# EAGLE design control_dev (EAGLE 8.3.2)
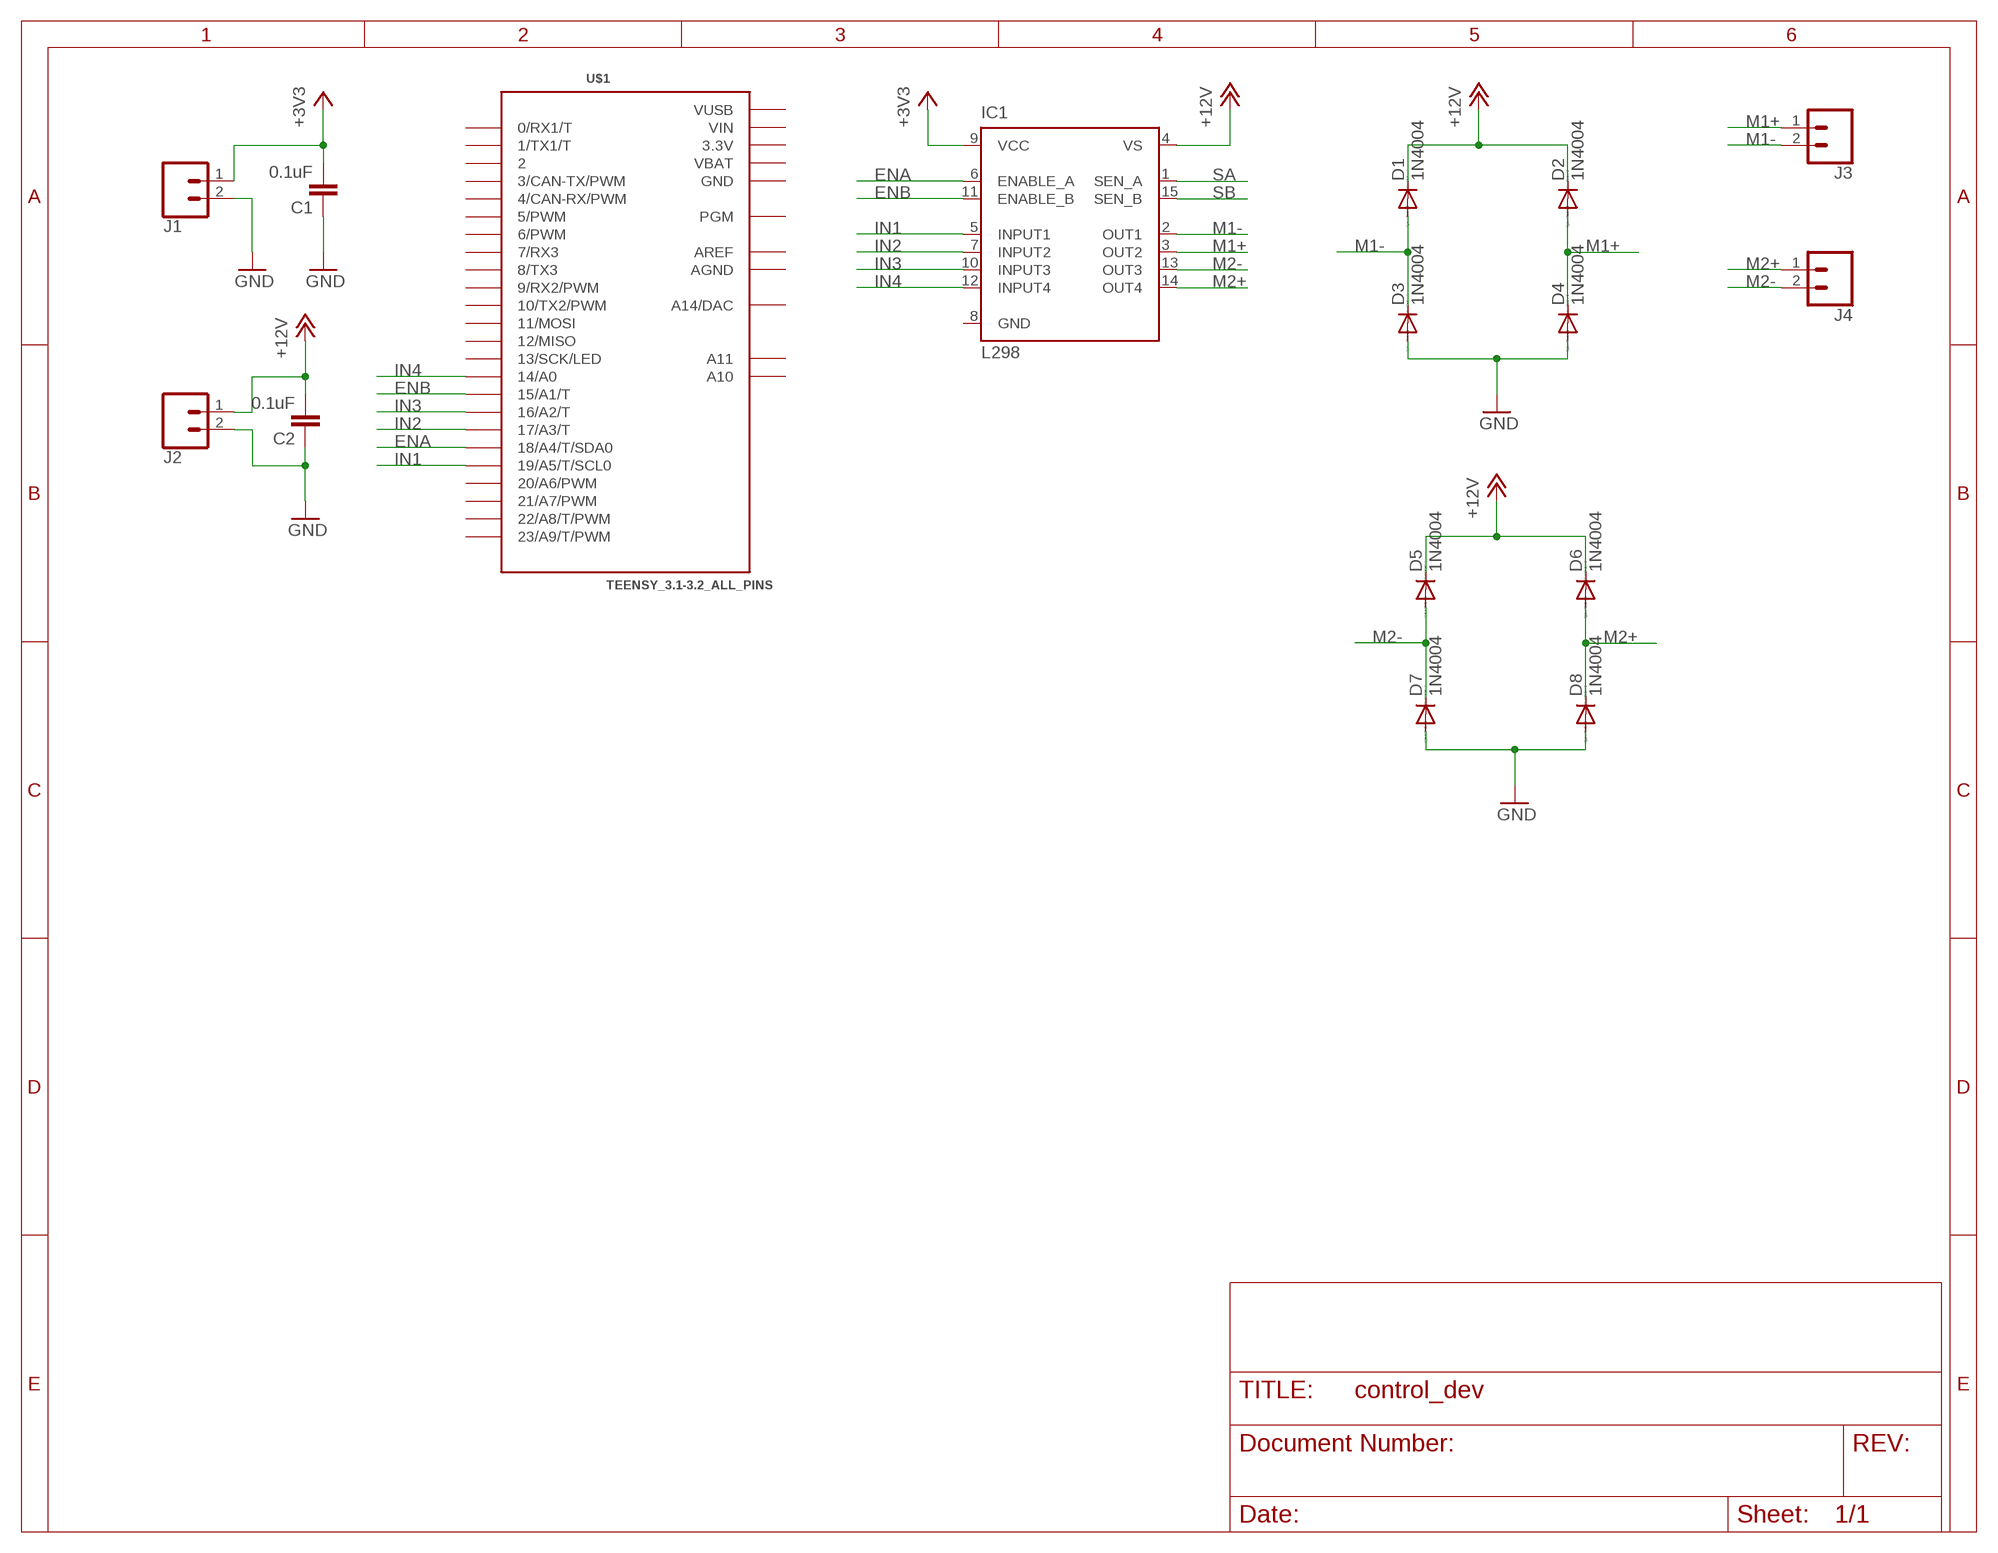
[diagram p0: schematic, sheet 1]

## Parts
C1  0.1uF  0.1UF-KIT-EZ-50V-20%  [CAP-PTH-SMALL-KIT]
C2  0.1uF  0.1UF-KIT-EZ-50V-20%  [CAP-PTH-SMALL-KIT]
D1  1N4004  [DO41-10]
D2  1N4004  [DO41-10]
D3  1N4004  [DO41-10]
D4  1N4004  [DO41-10]
D5  1N4004  [DO41-10]
D6  1N4004  [DO41-10]
D7  1N4004  [DO41-10]
D8  1N4004  [DO41-10]
IC1  L298  [MULTIWATT-15]
J1  CONN_023.5MM  [SCREWTERMINAL-3.5MM-2]
J2  CONN_023.5MM  [SCREWTERMINAL-3.5MM-2]
J3  CONN_023.5MM  [SCREWTERMINAL-3.5MM-2]
J4  CONN_023.5MM  [SCREWTERMINAL-3.5MM-2]
U$1  TEENSY_3.1-3.2_ALL_PINS  [TEENSY_3.0-3.2&LC_ALL_PINS]

## Nets
+3V3: C1.2 IC1.9(VCC) J1.1
+12V: C2.2 D1.C D2.C D5.C D6.C IC1.4(VS) J2.1
ENA: IC1.6(ENABLE_A) U$1.18/A4(18/A4/T/SDA0)
ENB: IC1.11(ENABLE_B) U$1.15/A1(15/A1/T)
GND: C1.1 C2.1 D3.A D4.A D7.A D8.A J1.2 J2.2
IN1: IC1.5(INPUT1) U$1.19/A5(19/A5/T/SCL0)
IN2: IC1.7(INPUT2) U$1.17/A3(17/A3/T)
IN3: IC1.10(INPUT3) U$1.16/A2(16/A2/T)
IN4: IC1.12(INPUT4) U$1.14/A0
M1+: D2.A D4.C IC1.3(OUT2) J3.1
M1-: D1.A D3.C IC1.2(OUT1) J3.2
M2+: D6.A D8.C IC1.14(OUT4) J4.1
M2-: D5.A D7.C IC1.13(OUT3) J4.2
SA: IC1.1(SEN_A)
SB: IC1.15(SEN_B)
Unconnected: U$1.0(0/RX1/T) U$1.1(1/TX1/T) U$1.2 U$1.3(3/CAN-TX/PWM) U$1.4(4/CAN-RX/PWM) U$1.5(5/PWM) U$1.6(6/PWM) U$1.7(7/RX3) U$1.8(8/TX3) U$1.9(9/RX2/PWM) U$1.10(10/TX2/PWM) U$1.11(11/MOSI) U$1.12(12/MISO) U$1.13(13/SCK/LED) U$1.20/A6(20/A6/PWM) U$1.21/A7(21/A7/PWM) U$1.22/A8(22/A8/T/PWM) U$1.23/A9(23/A9/T/PWM) U$1.A10 U$1.A11 U$1.PGM U$1.RESET/DAC(A14/DAC)

## Power pins joined to a net without a drawn wire
3.3V: U$1.3.3V U$1.3.3V1(3.3V)
AGND: U$1.AGND
AREF: U$1.AREF
GND: IC1.8(GND) U$1.GND U$1.GND1(GND)
VBAT: U$1.VBAT
VIN: U$1.VIN
VUSB: U$1.VUSB

## Library data of the parts
C1 C2 = SparkFun-Capacitors:0.1UF: 0.1µF ceramic capacitors A capacitor is a passive two-terminal electrical component used to store electrical energy temporarily in an electric field.; PROD_ID: CAP-08370
D1-D8 = diode:1N4004: DIODE general purpose rectifier, 1 A
IC1 = st-microelectronics:L298: DUAL FULL-BRIDGE DRIVER; MPN: L298N; OC_FARNELL: 1589425; OC_NEWARK: 32M1527
J1-J4 = SparkFun-Connectors:CONN_02: Multi connection point. Often used as Generic Header-pin footprint for 0.1 inch spaced/style header connections On any of the 0.1 inch spaced packages, you can populate with these: Break Away Headers - Straight <https://www.sparkfun.com/products/116> (PRT-00116) Break Away Male Headers - Right Angle <https://www.sparkfun.com/products/553> (PRT-00553) Female Headers <https://www.sparkfun.com/products/115> (PRT-00115) Break Away Headers - Machine Pin <https://www.sparkfun.com/products/117> (PRT-00117) Break Away Female Headers - Swiss Machine Pin <https://www.sparkfun.com/products/743> (PRT-00743) For SCREWTERMINALS and SPRING TERMINALS visit here: Screw Terimnals on SparkFun.com <https://www.sparkfun.com/search/results?term=Screw+Terminals> (5mm/3.5mm/2.54mm spacing) This device is also useful as a general connection point to wire up your design to another part of your project. Our various solder wires solder well into these plated through hole pads. Hook-Up Wire - Assortment (Stranded, 22 AWG) <https://www.sparkfun.com/products/11375> (PRT-11375) Hook-Up Wire - Assortment (Solid Core, 22 AWG) <https://www.sparkfun.com/products/11367> (PRT-11367) View the entire wire category on our website here <https://www.sparkfun.com/categories/141> Special notes: Molex polarized connector foot print use with: PRT-08233 with associated crimp pins and housings. 2.54_SCREWTERM for use with PRT-10571. 3.5mm Screw Terminal footprints for PRT-08084 5mm Screw Terminal footprints for use with PRT-08432; PROD_ID: CONN-08399
U$1 = Teensy_3_and_LC_Series_Boards_v1.4:TEENSY_3.1-3.2_ALL_PINS: Footprint for Teensy 3.1 or 3.2 board using all through-holes, i.e. the entire perimeter plus the 4 through-holes inboard (A10,A11,AREF, VUSB)

## Board
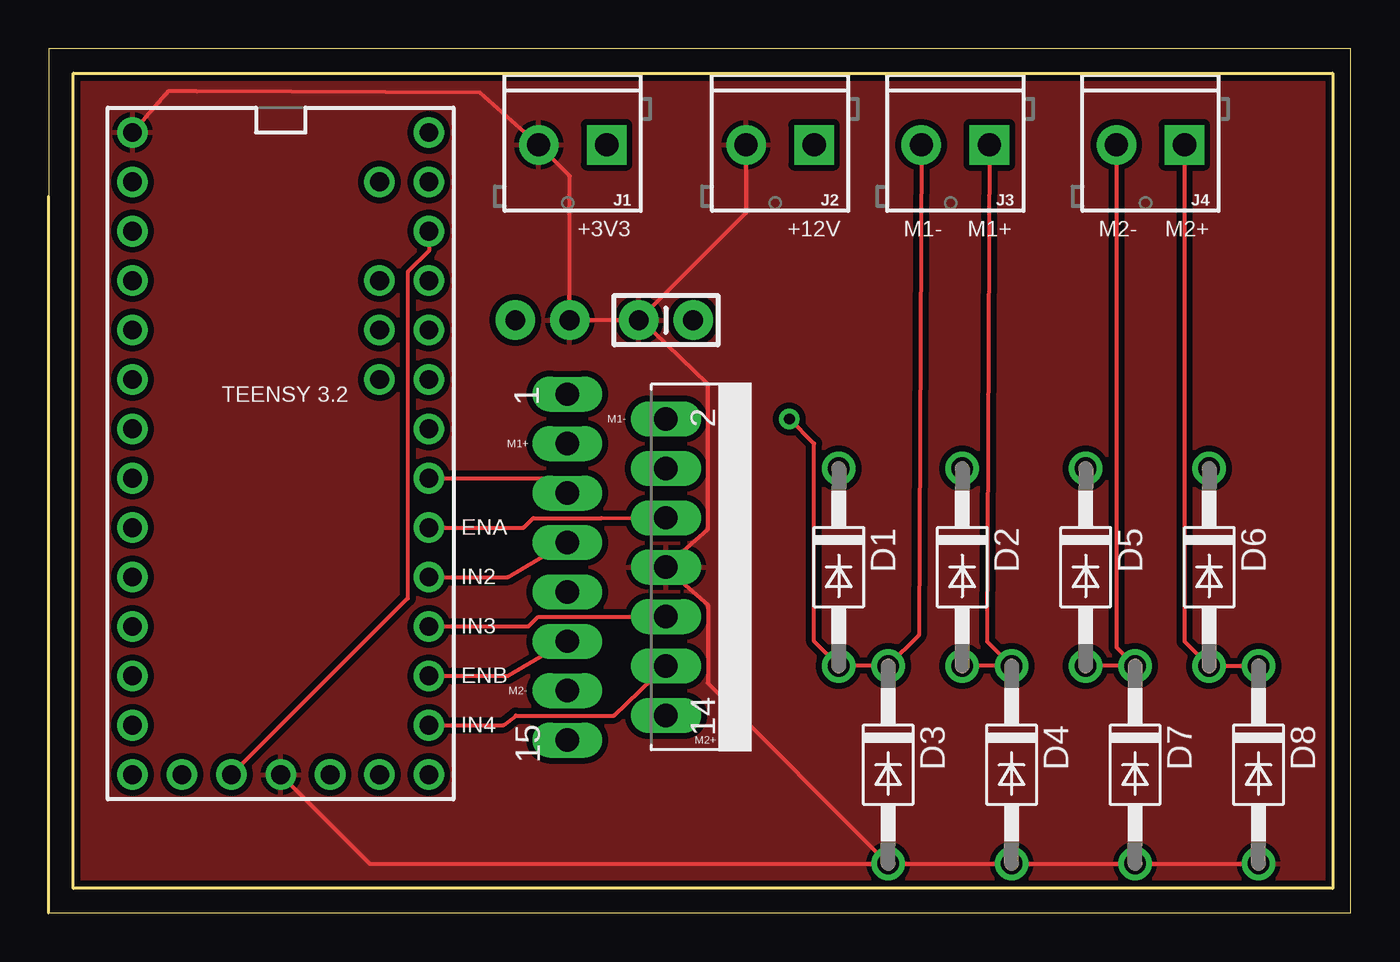
[diagram p1: board, top side]
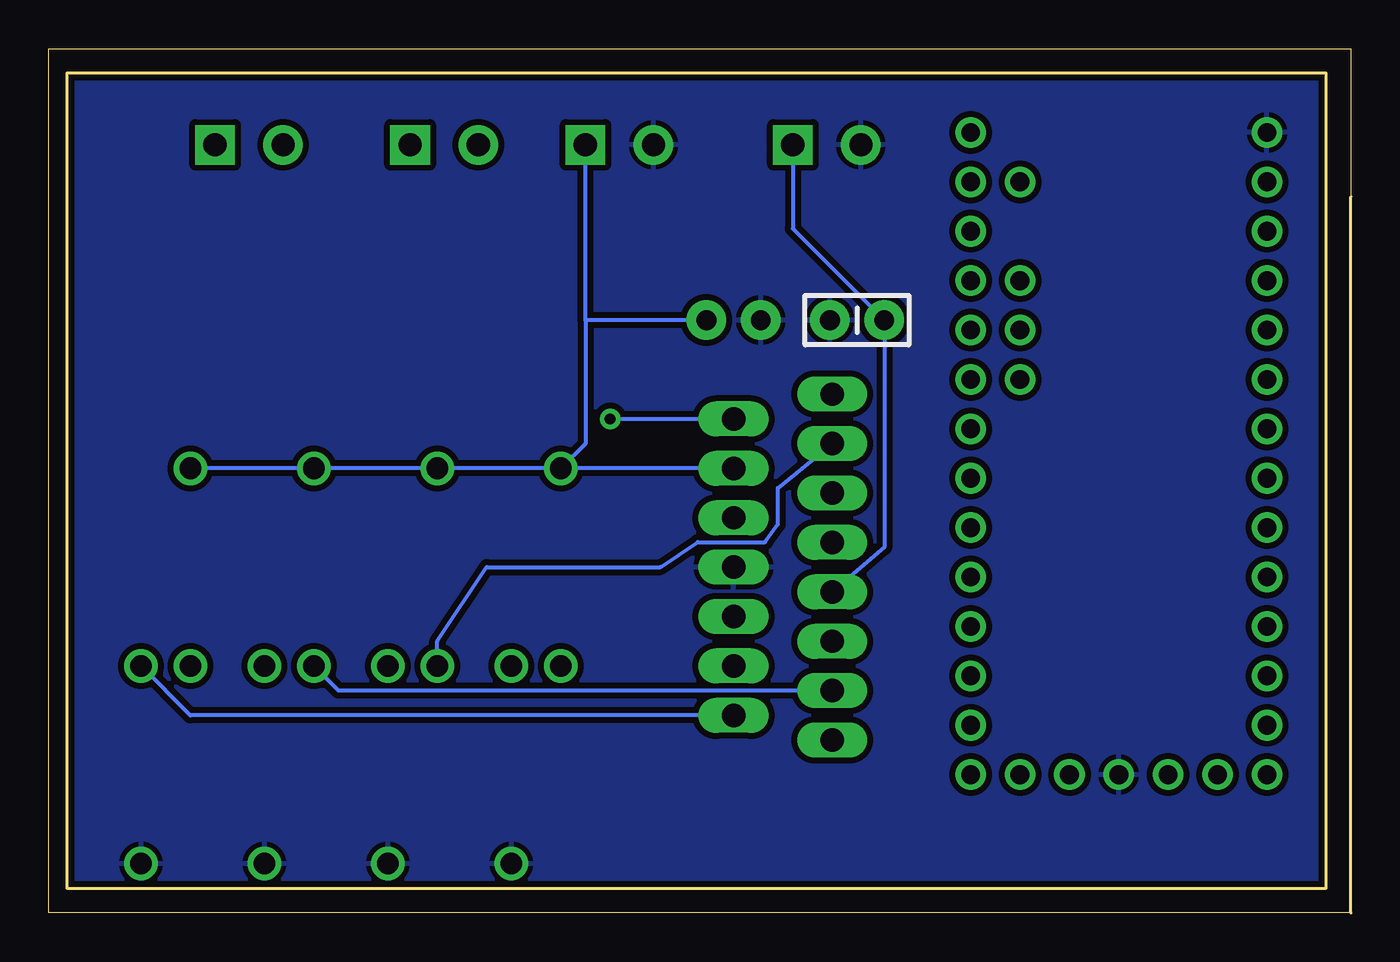
[diagram p2: board, bottom side, seen from below]

Size 66.98 x 44.44 mm. Coordinates in mm from the lower left corner, seen from the top.
Outline: 0,0 66.98,0 66.98,44.44 0,44.44 0,36.83 0,0
Outline: 1.27,1.27 1.27,43.18 66.04,43.18 66.04,1.27 1.27,1.27
Copper layers (1*16): Top 0.035mm / dielectric 1.5mm / Bottom 0.035mm
Design rules "SparkFun": minimum track width 8mil, minimum drill 20mil, track to track 8mil, track to pad 8mil, pad to pad 8mil, via to via 8mil, smd to smd 8mil, copper to edge 8mil, drill to drill 8mil, minimum pad ring 12mil, minimum via ring 10mil, stop-mask expansion 4mil, vias tented up to drill 20mil, thermal gap 10mil

### Footprints (pad centres in the part's own frame; a part is rotated, then mirrored left to right if it is on the bottom)
CAP-PTH-SMALL-KIT = drill 1.016 pad 2.032: 1 -1.397,0; 2 1.397,0
DO41-10 = drill 1.118: A 5.08,0; C -5.08,0
MULTIWATT-15 = drill 1.2 long: 1 -8.89,-7.62; 2 -7.62,-2.54; 3 -6.35,-7.62; 4 -5.08,-2.54; 5 -3.81,-7.62; 6 -2.54,-2.54; 7 -1.27,-7.62; 8 0,-2.54; 9 1.27,-7.62; 10 2.54,-2.54; 11 3.81,-7.62; 12 5.08,-2.54; 13 6.35,-7.62; 14 7.62,-2.54; 15 8.89,-7.62
SCREWTERMINAL-3.5MM-2 = drill 1.2 pad 2.032 square: 1 0,0 | drill 1.2 pad 2.032: 2 3.5,0
TEENSY_3.0-3.2&LC_ALL_PINS = drill 0.965: 0 -7.62,13.97; 1 -7.62,11.43; 2 -7.62,8.89; 3 -7.62,6.35; 3.3V 7.62,11.43; 3.3V1 -2.54,-16.51; 4 -7.62,3.81; 5 -7.62,1.27; 6 -7.62,-1.27; 7 -7.62,-3.81; 8 -7.62,-6.35; 9 -7.62,-8.89; 10 -7.62,-11.43; 11 -7.62,-13.97; 12 -7.62,-16.51; 13 7.62,-16.51; 14/A0 7.62,-13.97; 15/A1 7.62,-11.43; 16/A2 7.62,-8.89; 17/A3 7.62,-6.35; 18/A4 7.62,-3.81; 19/A5 7.62,-1.27; 20/A6 7.62,1.27; 21/A7 7.62,3.81; 22/A8 7.62,6.35; 23/A9 7.62,8.89; A10 5.08,6.35; A11 5.08,3.81; AGND 7.62,13.97; AREF 5.08,8.89; GND -7.62,16.51; GND1 0,-16.51; PGM 2.54,-16.51; RESET/DAC 5.08,-16.51; VBAT -5.08,-16.51; VIN 7.62,16.51; VUSB 5.08,13.97

### Placement (x,y rotation side)
C1  25.4,30.48 0 bottom
C2  31.75,30.48 0 top
D1  40.64,17.78 270 top
D2  46.99,17.78 270 top
D3  43.18,7.62 270 top
D4  49.53,7.62 270 top
D5  53.34,17.78 270 top
D6  59.69,17.78 270 top
D7  55.88,7.62 270 top
D8  62.23,7.62 270 top
IC1  34.29,17.78 270 top
J1  28.7,39.5 180 top
J2  39.37,39.5 180 top
J3  48.39,39.5 180 top
J4  58.42,39.5 180 top
U$1  11.94,23.62 0 top

### Tracks (layer width: path | path; a pad name or v marks a point on that pad's centre or on a via)
3.3V
  Top 0.203: U$1.3.3V 19.56,34.06 18.47,32.96 18.47,16.18 U$1.3.3V1
+3V3
  Bottom 0.203: J1.1 28.7,35.18 C1.2 24,18.8 IC1.9
+12V
  Bottom 0.203: D1.C 39.37,24.13 39.37,30.48 | IC1.4 D1.C | D1.C D2.C D5.C D6.C | 39.37,30.48 J2.1 | C2.2 39.37,30.48
ENA
  Top 0.203: U$1.18/A4 24.43,19.81 24.92,20.31 28.43,20.31 IC1.6
ENB
  Top 0.203: U$1.15/A1 23.62,12.19 IC1.11
GND
  Top 0.203: D3.A 16.51,2.54 U$1.GND1 | D3.A 33.91,11.81 33.91,15.83 31.75,17.74 IC1.8 31.75,17.82 33.91,19.73 33.91,27.18 30.42,30.54 | U$1.GND 6.15,42.24 7.64,42.24 22.19,42.16 J1.2 26.8,37.9 C1.1 C2.1 30.42,30.54 | J2.2 35.87,36 30.42,30.54 | D3.A D4.A D7.A D8.A
  pour Top (isolate 0.305): 1.27,41.91 1.27,1.27 66.04,1.27 66.04,43.18 1.27,43.18
  pour Bottom (isolate 0.305): 1.27,43.18 1.27,1.27 66.04,1.27 66.04,43.18
IN1
  Top 0.203: U$1.19/A5 25.91,22.35 IC1.5
IN2
  Top 0.203: U$1.17/A3 23.62,17.27 IC1.7
IN3
  Top 0.203: U$1.16/A2 24.68,14.73 25.18,15.23 29.83,15.23 IC1.10
IN4
  Top 0.203: U$1.14/A0 23.41,9.65 24.03,10.15 29.07,10.15 IC1.12
M1+
  Top 0.203: D2.A D4.C 48.26,13.97 J3.1
  Bottom 0.203: D2.A 46.99,13.97 44.45,17.78 35.52,17.78 33.6,19.06 30.13,19.06 29.47,19.98 29.47,21.84 IC1.3
M1-  (via drill 0.55)
  Top 0.203: J3.2 44.76,14.28 D3.C D1.A 39.37,13.97 39.37,24.13 v38.1,25.4
  Bottom 0.203: v38.1,25.4 IC1.2
M2+
  Top 0.203: D8.C D6.A 58.42,13.97 J4.1
  Bottom 0.203: IC1.14 59.69,10.16 D8.C
M2-
  Top 0.203: D5.A D7.C 54.92,13.66 J4.2
  Bottom 0.203: IC1.13 52.07,11.43 D5.A

### Text on the board
tPlace: +3V3 | +12V | M1- | M1+ | M2- | M2+ | TEENSY 3.2 | M1- | M1+ | ENA | IN2 | IN3 | ENB | M2- | IN4 | M2+
tValues: IN1